# Altium schematic sheet pressure.SchDoc: Pressure Sensor
size A4; CheckedBy: rrodrigu; Author: Satxo; CompanyName: Satxo; Revision: 0v1; SheetNumber: 5; SheetTotal: 8; ProjectName: Basestation
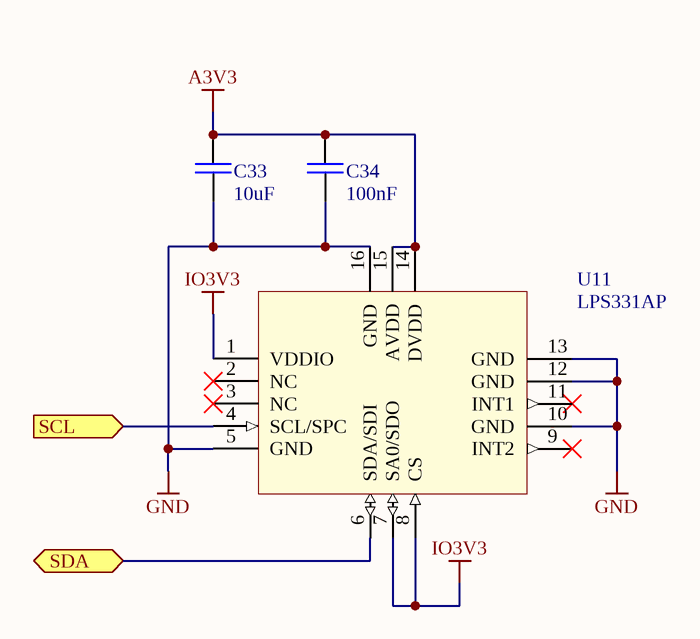
[diagram p0: pressure.SchDoc]

## Parts
C33  10uF  [0805]
C34  100nF  [0603]
U11  LPS331AP  [HCLGA-16]

## Ports
SCL (in), SDA (bidir)

## Nets
A3V3: C33.2 C34.2 U11.14(DVDD) U11.15(AVDD)
GND: C33.1 C34.1 U11.5(GND) U11.10(GND) U11.12(GND) U11.13(GND) U11.16(GND)
IO3V3: U11.1(VDDIO) U11.7(SA0/SDO) U11.8(CS)
SCL: U11.4(SCL/SPC) ; port SCL
SDA: U11.6(SDA/SDI) ; port SDA

Not connected (* = marked no-connect by the designer): U11 2(NC)* 3(NC)* 9(INT2)* 11(INT1)*

## Notes on the sheet
- Title
- Size:
- Date:
- A4
- Number:
- Time:
- Revision:
- Sheet
- of
- File:

## Library data of the parts
C33 C34 = CAP: Capacitor; Owner: Nuno Brum; Sub-Type: Ceramic; Assembly: INS; Maximum Voltage: *; Creation Date: 2005-04-28; Status: Valid; Validation date: 2006-05-15; Type: Capacitor
U11 = LPS331AP: Pressure sensor, 260 - 1260 mbar; Creation Date: 2012-12-06; Type: IC